# EAGLE design Arduino_MEGA2560_ref (EAGLE 6.5.0)
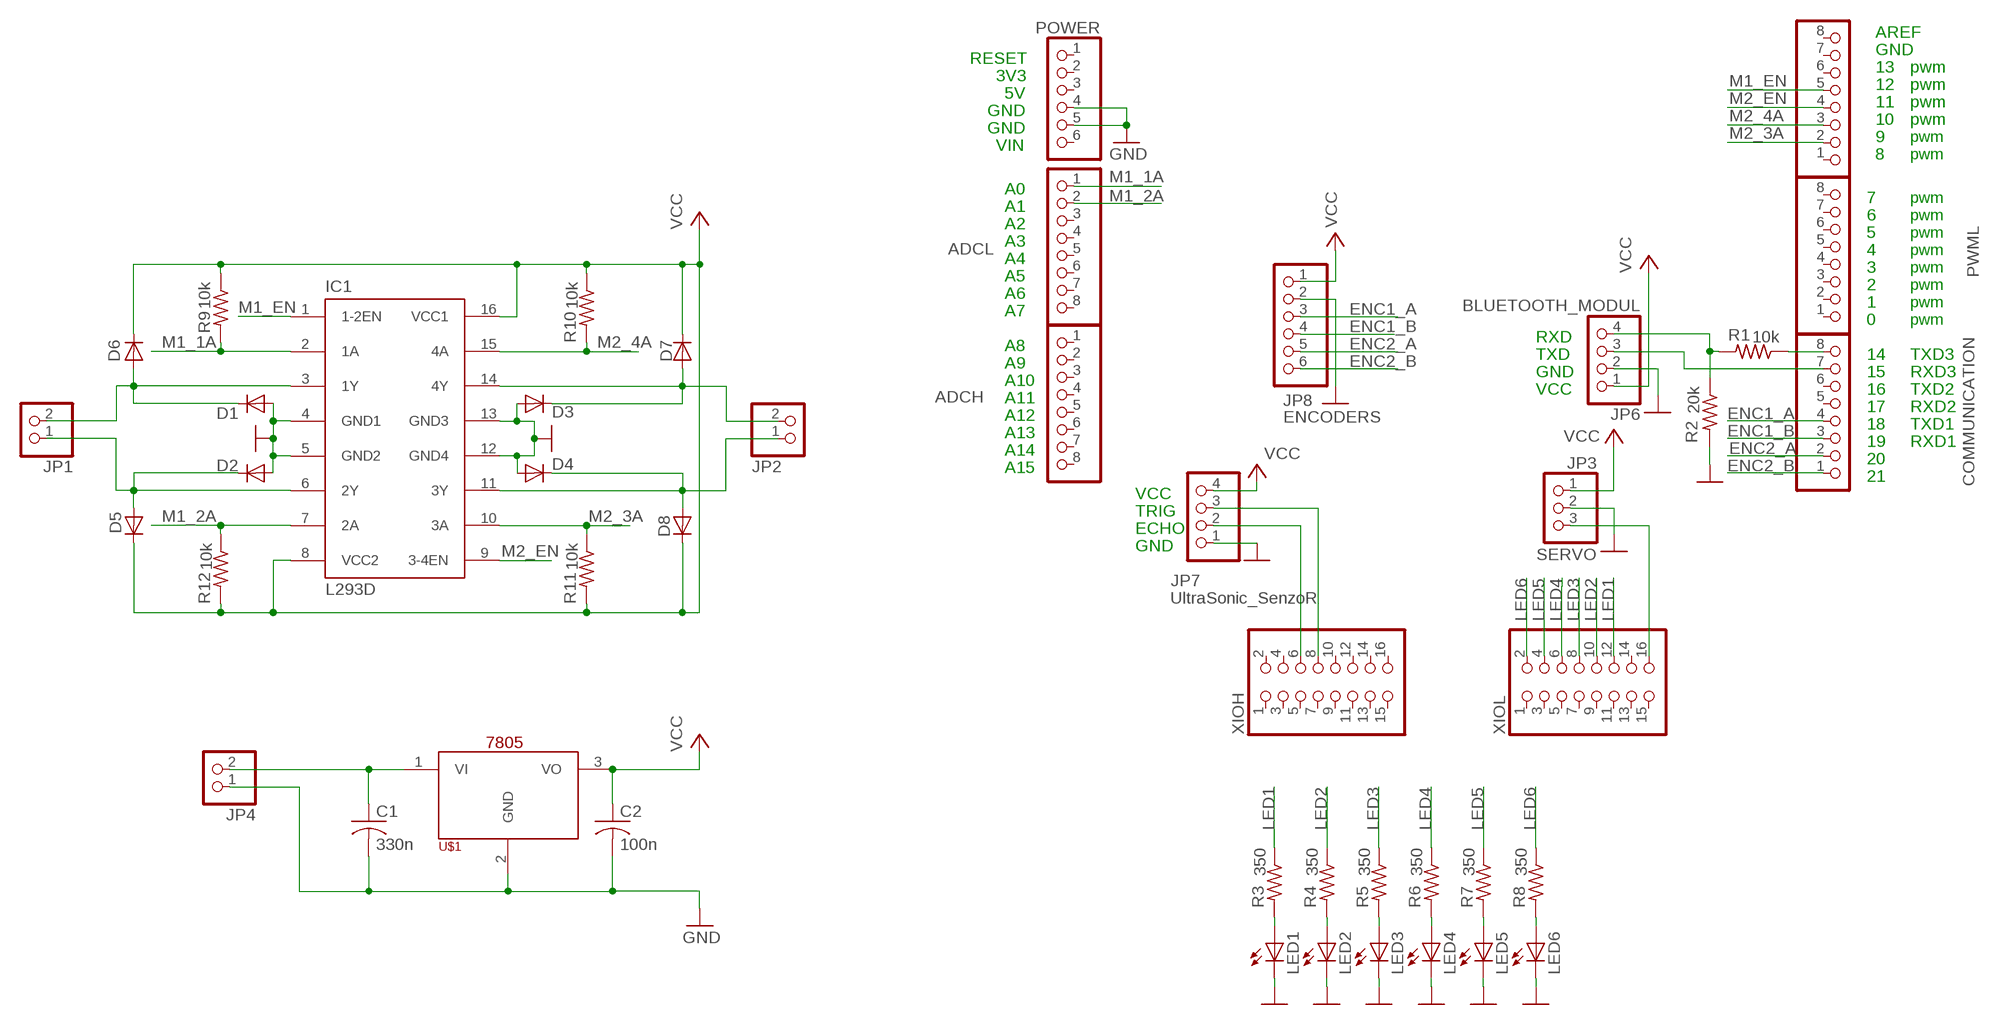
[diagram p0: schematic, sheet 1]

## Parts
ADCH  PINHD-1X8  [1X08]
ADCL  PINHD-1X8  [1X08]
C1  330n  C-USC0805  [C0805]
C2  100n  C-USC0805  [C0805]
COMMUNICATION  PINHD-1X8  [1X08]
D1  PMLL4150  [SOD80C]
D2  PMLL4150  [SOD80C]
D3  PMLL4150  [SOD80C]
D4  PMLL4150  [SOD80C]
D5  PMLL4150  [SOD80C]
D6  PMLL4150  [SOD80C]
D7  PMLL4150  [SOD80C]
D8  PMLL4150  [SOD80C]
IC1  L293D  [DIL16]
JP1  PINHD-1X2  [1X02]
JP2  PINHD-1X2  [1X02]
JP3  SERVO  PINHD-1X3  [1X03]
JP4  PINHD-1X2  [1X02]
JP6  BLUETOOTH_MODUL  PINHD-1X4  [1X04]
JP7  UltraSonic_SenzoR  PINHD-1X4  [1X04]
JP8  ENCODERS  PINHD-1X6  [1X06]
LED1  LED  [SMARTLED-TTW]
LED2  LED  [SMARTLED-TTW]
LED3  LED  [SMARTLED-TTW]
LED4  LED  [SMARTLED-TTW]
LED5  LED  [SMARTLED-TTW]
LED6  LED  [SMARTLED-TTW]
POWER  PINHD-1X6  [1X06]
PWMH  PINHD-1X8  [1X08]
PWML  PINHD-1X8  [1X08]
R1  10k  R-US_R0805  [R0805]
R2  20k  R-US_R0805  [R0805]
R3  350  R-US_R0805  [R0805]
R4  350  R-US_R0805  [R0805]
R5  350  R-US_R0805  [R0805]
R6  350  R-US_R0805  [R0805]
R7  350  R-US_R0805  [R0805]
R8  350  R-US_R0805  [R0805]
R9  10k  R-US_R0805  [R0805]
R10  10k  R-US_R0805  [R0805]
R11  10k  R-US_R0805  [R0805]
R12  10k  R-US_R0805  [R0805]
U$1  7805  [TO-220]
XIOH  PINHD-2X8  [2X08]
XIOL  PINHD-2X8  [2X08]

## Nets
ENC1_A: COMMUNICATION.4 JP8.3
ENC1_B: COMMUNICATION.3 JP8.4
ENC2_A: COMMUNICATION.2 JP8.5
ENC2_B: COMMUNICATION.1 JP8.6
GND [Ground]: C1.2 C2.2 D1.A D2.A D3.A D4.A IC1.4(GND1) IC1.5(GND2) IC1.12(GND4) IC1.13(GND3) JP3.2 JP4.1 JP6.2 JP7.1 JP8.2 LED1.C@1(C) LED2.C@1(C) LED3.C@1(C) LED4.C@1(C) LED5.C@1(C) LED6.C@1(C) POWER.4 POWER.5 R2.2 U$1.2(GND)
LED1: R3.1 XIOL.12
LED2: R4.1 XIOL.10
LED3: R5.1 XIOL.8
LED4: R6.1 XIOL.6
LED5: R7.1 XIOL.4
LED6: R8.1 XIOL.2
M1_1A: ADCL.1 IC1.2(1A) R9.2
M1_2A: ADCL.2 IC1.7(2A) R12.1
M1_EN: IC1.1(1-2EN) PWMH.5
M2_3A: D4.C D8.A IC1.11(3Y) JP2.1 PWMH.2
M2_4A: IC1.15(4A) PWMH.3 R10.2
M2_EN: IC1.9(3-4EN) PWMH.4
N$1: D1.C D6.A IC1.3(1Y) JP1.2
N$2: D2.C D5.A IC1.6(2Y) JP1.1
N$3: D3.C D7.A IC1.14(4Y) JP2.2
N$5: JP3.3 XIOL.16
N$6: COMMUNICATION.7 JP6.3
N$7: COMMUNICATION.8 R1.1
N$8: JP6.4 R1.2 R2.1
N$9: C1.1 JP4.2 U$1.1(VI)
N$10: JP7.3 XIOH.8
N$11: JP7.2 XIOH.6
N$12: LED1.A@1(A) R3.2
N$13: LED2.A@1(A) R4.2
N$14: LED3.A@1(A) R5.2
N$15: LED4.A@1(A) R6.2
N$16: LED5.A@1(A) R7.2
N$17: LED6.A@1(A) R8.2
N$18: IC1.10(3A) R11.1
VCC [VCC_]: C2.1 D5.C D6.C D7.C D8.C IC1.8(VCC2) IC1.16(VCC1) JP3.1 JP6.1 JP7.4 JP8.1 R9.1 R10.1 R11.2 R12.2 U$1.3(VO)
Unconnected: ADCH.1 ADCH.2 ADCH.3 ADCH.4 ADCH.5 ADCH.6 ADCH.7 ADCH.8 ADCL.3 ADCL.4 ADCL.5 ADCL.6 ADCL.7 ADCL.8 COMMUNICATION.5 COMMUNICATION.6 POWER.1 POWER.2 POWER.3 POWER.6 PWMH.1 PWMH.6 PWMH.7 PWMH.8 PWML.1 PWML.2 PWML.3 PWML.4 PWML.5 PWML.6 PWML.7 PWML.8 XIOH.1 XIOH.2 XIOH.3 XIOH.4 XIOH.5 XIOH.7 XIOH.9 XIOH.10 XIOH.11 XIOH.12 XIOH.13 XIOH.14 XIOH.15 XIOH.16 XIOL.1 XIOL.3 XIOL.5 XIOL.7 XIOL.9 XIOL.11 XIOL.13 XIOL.14 XIOL.15

## Notes on the sheet
- AREF
- GND
- RESET
- 13 | pwm
- 3V3
- 12 | pwm
- 5V
- 11 | pwm
- GND
- 10 | pwm
- GND
- 9 | pwm
- VIN
- 8 | pwm
- A0
- 7 | pwm
- A1
- 6 | pwm
- A2
- 5 | pwm
- A3
- 4 | pwm
- A4
- 3 | pwm
- A5
- 2 | pwm
- A6
- 1 | pwm
- A7
- 0 | pwm
- RXD
- A8
- TXD | 14 | TXD3
- A9
- GND | 15 | RXD3
- A10
- VCC | 16 | TXD2
- A11
- 17 | RXD2
- A12
- 18 | TXD1
- A13
- 19 | RXD1
- A14
- 20
- A15
- 21
- VCC
- TRIG
- ECHO
- GND

## Library data of the parts
ADCH ADCL COMMUNICATION PWMH PWML = pinhead:PINHD-1X8: PIN HEADER
C1 C2 = adafruit:C-US: CAPACITOR, American symbol
D1-D8 = diode:PMLL4150: DIODE high speed
IC1 = st-microelectronics:L293D: PUSH-PULL 4 CHANNEL DRIVER; MPN: L293D; OC_FARNELL: 9589619; OC_NEWARK: 56P8249
JP1 JP2 JP4 = pinhead:PINHD-1X2: PIN HEADER
JP3 = pinhead:PINHD-1X3: PIN HEADER
JP6 JP7 = pinhead:PINHD-1X4: PIN HEADER
JP8 POWER = pinhead:PINHD-1X6: PIN HEADER
LED1-LED6 = adafruit:LED: LED OSRAM: - CHIPLED LG R971, LG N971, LY N971, LG Q971, LY Q971, LO R971, LY R971 LH N974, LH R974 LS Q976, LO Q976, LY Q976 LO Q996 - Hyper CHIPLED LW Q18S LB Q993, LB Q99A, LB R99A - SideLED LS A670, LO A670, LY A670, LG A670, LP A670 LB A673, LV A673, LT A673, LW A673 LH A674 LY A675 LS A676, LA A676, LO A676, LY A676, LW A676 LS A679, LY A679, LG A679 - Hyper Micro SIDELED® LS Y876, LA Y876, LO Y876, LY Y876 LT Y87S - SmartLED LW L88C, LW L88S LB L89C, LB L89S, LG L890 LS L89K, LO L89K, LY L89K LS L896, LA L896, LO L896, LY L896 - TOPLED LS T670, LO T670, LY T670, LG T670, LP T670 LSG T670, LSP T670, LSY T670, LOP T670, LYG T670 LG T671, LOG T671, LSG T671 LB T673, LV T673, LT T673, LW T673 LH T674 LS T676, LA T676, LO T676, LY T676, LB T676, LH T676, LSB T676, LW T676 LB T67C, LV T67C, LT T67C, LS T67K, LO T67K, LY T67K, LW E67C LS E67B, LA E67B, LO E67B, LY E67B, LB E67C, LV E67C, LT E67C LW T67C LS T679, LY T679, LG T679 LS T770, LO T770, LY T770, LG T770, LP T770 LB T773, LV T773, LT T773, LW T773 LH T774 LS E675, LA E675, LY E675, LS T675 LS T776, LA T776, LO T776, LY T776, LB T776 LHGB T686 LT T68C, LB T68C - Hyper Mini TOPLED® LB M676 - Mini TOPLED Santana® LG M470 LS M47K, LO M47K, LY M47K Source: http://www.osram.convergy.de/
R1-R12 = adafruit:R-US_: RESISTOR, American symbol
U$1 = my_lib:7805
XIOH XIOL = pinhead:PINHD-2X8: PIN HEADER

## Net classes
0 default: width 0.508 mm, drill 20 mm, clearance 0.2 mm
1 Ground: width 1.016 mm, clearance 0.2 mm
2 VCC_: width 1.016 mm, clearance 0.2 mm

## Board
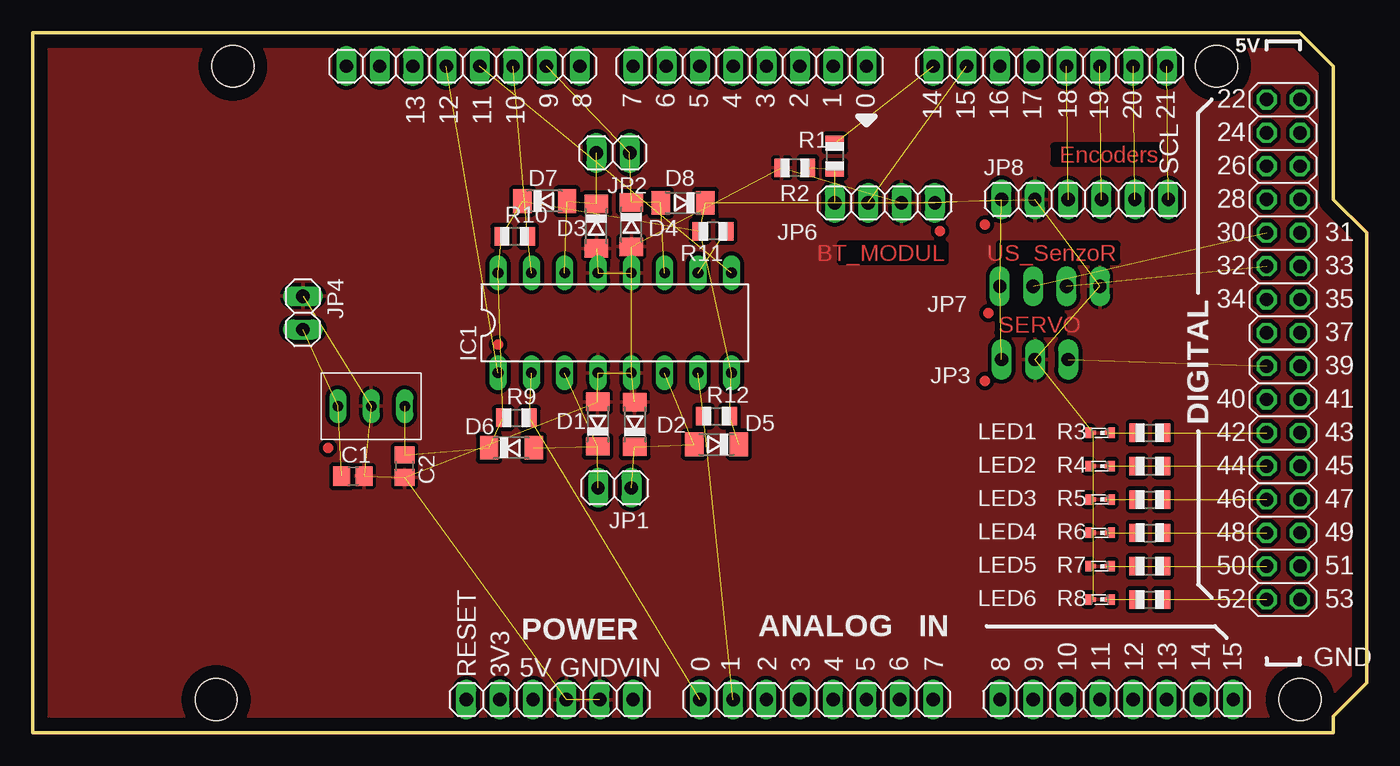
[diagram p1: board, top side]
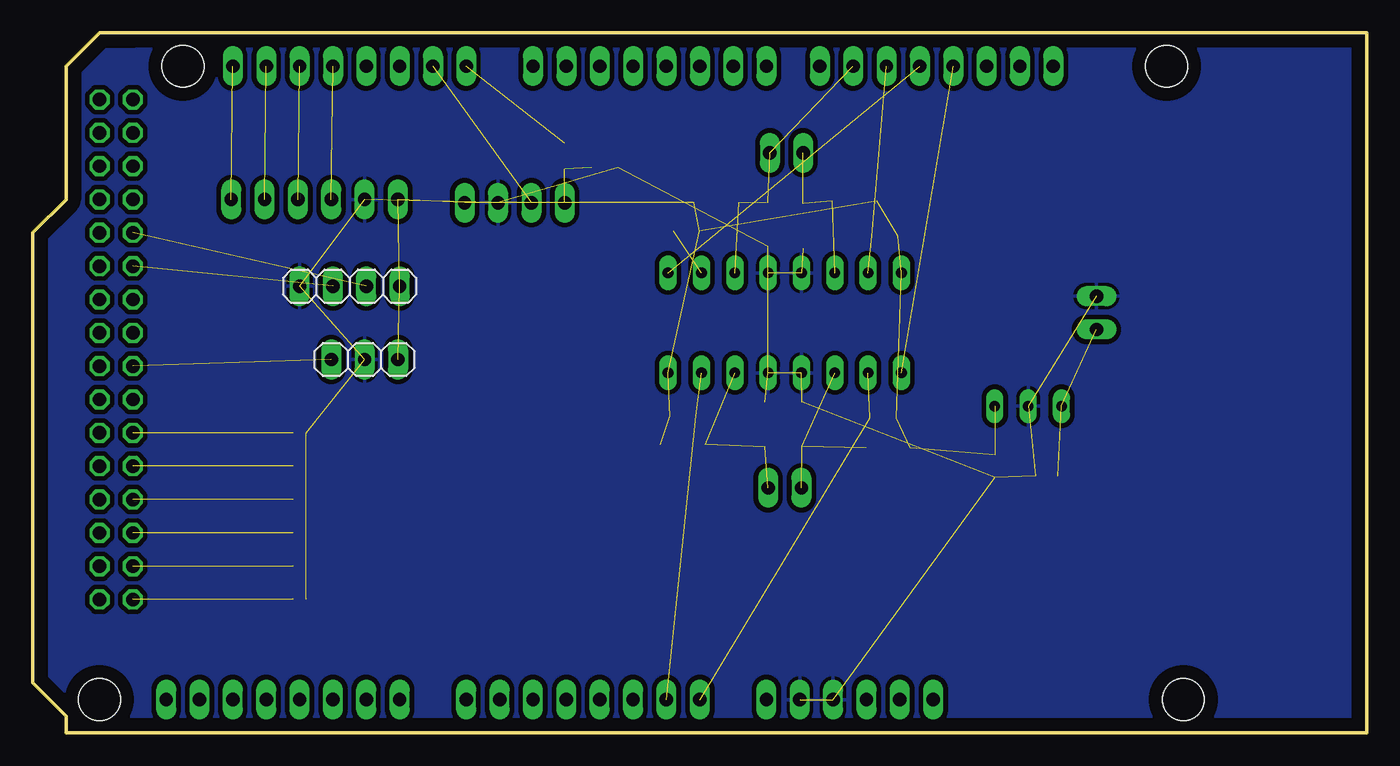
[diagram p2: board, bottom side, seen from below]

Size 101.6 x 53.34 mm. Coordinates in mm from the lower left corner, seen from the top.
Outline: 0,53.34 96.52,53.34 99.06,50.8 99.06,40.64 101.6,38.1 101.6,3.81 99.06,1.27 99.06,0 0,0 0,53.34
Copper layers (1*16): Top 0.035mm / dielectric 1.5mm / Bottom 0.035mm
Design rules "default": minimum track width 6mil, minimum drill 12mil, track to track 6mil, track to pad 6mil, pad to pad 6mil, via to via 6mil, smd to smd 6mil, copper to edge 40mil, drill to drill 12mil, minimum pad ring 10mil, minimum via ring 10mil, stop-mask expansion 2mil, vias tented up to drill 1mil, thermal gap 10mil
Holes 3.2 mm at 96.52,2.54 15.24,50.8 90.17,50.8 13.97,2.54

### Footprints (pad centres in the part's own frame; a part is rotated, then mirrored left to right if it is on the bottom)
1X08 = drill 1.016 long: 1 -8.89,0; 2 -6.35,0; 3 -3.81,0; 4 -1.27,0; 5 1.27,0; 6 3.81,0; 7 6.35,0; 8 8.89,0
C0805 = smd 1.3 x 1.5: 1 -0.85,0; 2 0.85,0
SOD80C = smd 1.4 x 1.8: A 1.7,0; C -1.7,0
DIL16 = drill 0.813 long: 1 -8.89,-3.81; 2 -6.35,-3.81; 3 -3.81,-3.81; 4 -1.27,-3.81; 5 1.27,-3.81; 6 3.81,-3.81; 7 6.35,-3.81; 8 8.89,-3.81; 9 8.89,3.81; 10 6.35,3.81; 11 3.81,3.81; 12 1.27,3.81; 13 -1.27,3.81; 14 -3.81,3.81; 15 -6.35,3.81; 16 -8.89,3.81
1X02 = drill 1.016 long: 1 -1.27,0; 2 1.27,0
1X03 = drill 1.016 long: 1 -2.54,0; 2 0,0; 3 2.54,0
1X04 = drill 1.016 long: 1 -3.81,0; 2 -1.27,0; 3 1.27,0; 4 3.81,0
1X06 = drill 1.016 long: 1 -6.35,0; 2 -3.81,0; 3 -1.27,0; 4 1.27,0; 5 3.81,0; 6 6.35,0
SMARTLED-TTW = smd 0.8 x 0.5: A 0,-0.875; C 0,0.875 | smd 0.35 x 0.35: A@1 0,-0.5; C@1 0,0.5
R0805 = smd 1.1 x 1.4: 1 -1,0; 2 1,0
TO-220 = drill 0.8 long: 1 0,2.54; 2 0,0; 3 0,-2.54
2X08 = drill 1.016 octagon: 1 -8.89,-1.27; 2 -8.89,1.27; 3 -6.35,-1.27; 4 -6.35,1.27; 5 -3.81,-1.27; 6 -3.81,1.27; 7 -1.27,-1.27; 8 -1.27,1.27; 9 1.27,-1.27; 10 1.27,1.27; 11 3.81,-1.27; 12 3.81,1.27; 13 6.35,-1.27; 14 6.35,1.27; 15 8.89,-1.27; 16 8.89,1.27

### Placement (x,y rotation side)
ADCH  82.55,2.54 0 top
ADCL  59.69,2.54 0 top
C1  24.38,19.56 0 top
C2  28.32,20.32 270 top
COMMUNICATION  77.47,50.8 180 top
D1  43.03,23.52 90 top
D2  45.85,23.5 90 top
D3  42.93,38.61 270 top
D4  45.59,38.73 270 top
D5  52.07,21.97 180 top
D6  36.45,21.72 0 top
D7  38.99,40.51 0 top
D8  49.53,40.39 180 top
IC1  44.32,31.24 0 top
JP1  44.32,18.67 180 top
JP2  44.2,44.2 180 top
JP3  76.33,28.45 180 bottom
JP4  20.57,32 270 top
JP6  64.9,40.39 180 top
JP7  77.47,34.04 0 bottom
JP8  80.14,40.64 0 top
LED1  81.28,22.86 90 top
LED2  81.28,20.32 90 top
LED3  81.28,17.78 90 top
LED4  81.28,15.24 90 top
LED5  81.28,12.7 90 top
LED6  81.28,10.16 90 top
POWER  39.37,2.54 0 top
PWMH  32.77,50.8 180 top
PWML  54.61,50.8 180 top
R1  61.09,43.94 270 top
R2  58.04,43.05 180 top
R3  85.09,22.86 0 top
R4  85.09,20.32 0 top
R5  85.09,17.78 0 top
R6  85.09,15.24 0 top
R7  85.09,12.7 0 top
R8  85.09,10.16 0 top
R9  36.83,24 0 top
R10  36.7,37.85 0 top
R11  51.82,38.23 180 top
R12  52.07,24.13 0 top
U$1  25.78,24.89 90 top
XIOH  95.25,39.37 90 top
XIOL  95.25,19.05 90 top

### Tracks (layer width: path | path; a pad name or v marks a point on that pad's centre or on a via)
ENC1_A  (1 unrouted)
ENC1_B  (1 unrouted)
ENC2_A  (1 unrouted)
ENC2_B  (1 unrouted)
GND  (24 unrouted)
  pour Top (isolate 0.305, rank 2): 101.6,53.09 101.6,0.64 0.89,1.02 0.51,1.02 0.51,52.7
  pour Bottom (isolate 0.356, rank 2): 102.23,52.07 102.23,0.64 1.27,0.64 0.64,1.27 0.51,50.29 0.38,52.96
LED1  (1 unrouted)
LED2  (1 unrouted)
LED3  (1 unrouted)
LED4  (1 unrouted)
LED5  (1 unrouted)
LED6  (1 unrouted)
M1_1A  (2 unrouted)
M1_2A  (2 unrouted)
M1_EN  (1 unrouted)
M2_3A  (4 unrouted)
M2_4A  (2 unrouted)
M2_EN  (1 unrouted)
N$1  (3 unrouted)
N$2  (3 unrouted)
N$3  (3 unrouted)
N$5  (1 unrouted)
N$6  (1 unrouted)
N$7  (1 unrouted)
N$8  (2 unrouted)
N$9  (2 unrouted)
N$10  (1 unrouted)
N$11  (1 unrouted)
N$12  (1 unrouted)
N$13  (1 unrouted)
N$14  (1 unrouted)
N$15  (1 unrouted)
N$16  (1 unrouted)
N$17  (1 unrouted)
N$18  (1 unrouted)
VCC  (15 unrouted)
(copper drawn outside any net)
  shapes: Top circle x6

### Text on the board
Top: Encoders | BT_MODUL | US_SenzoR | SERVO
tPlace: 18 | 9 | 8 | 7 | 6 | 5 | 4 | 3 | 2 | 1 | 0 | 22 | 14 | 15 | 16 | 17 | 19 | 20 | 21 | 13 | 12 | 11 | 10 | 24 | 26 | 28 | 30 | 31 | 32 | 33 | 34 | 35 | 37 | 39 | 40 | 41 | 42 | 43 | 44 | 45 | 46 | 47 | 48 | 49 | 50 | 51 | 52 | 53 | 0 | 1 | 2 | 3 | 4 | 5 | 6 | 7 | 8 | 9 | 10 | 11 | 12 | 13 | 14 | 15
tNames: 5V | SCL | DIGITAL | ANALOG IN | GND | RESET | 3V3 | 5V | GND | VIN
ReferenceLC: L | TX | RX | PC1 | PC2